# Altium project 6s Power Module.PrjPcb
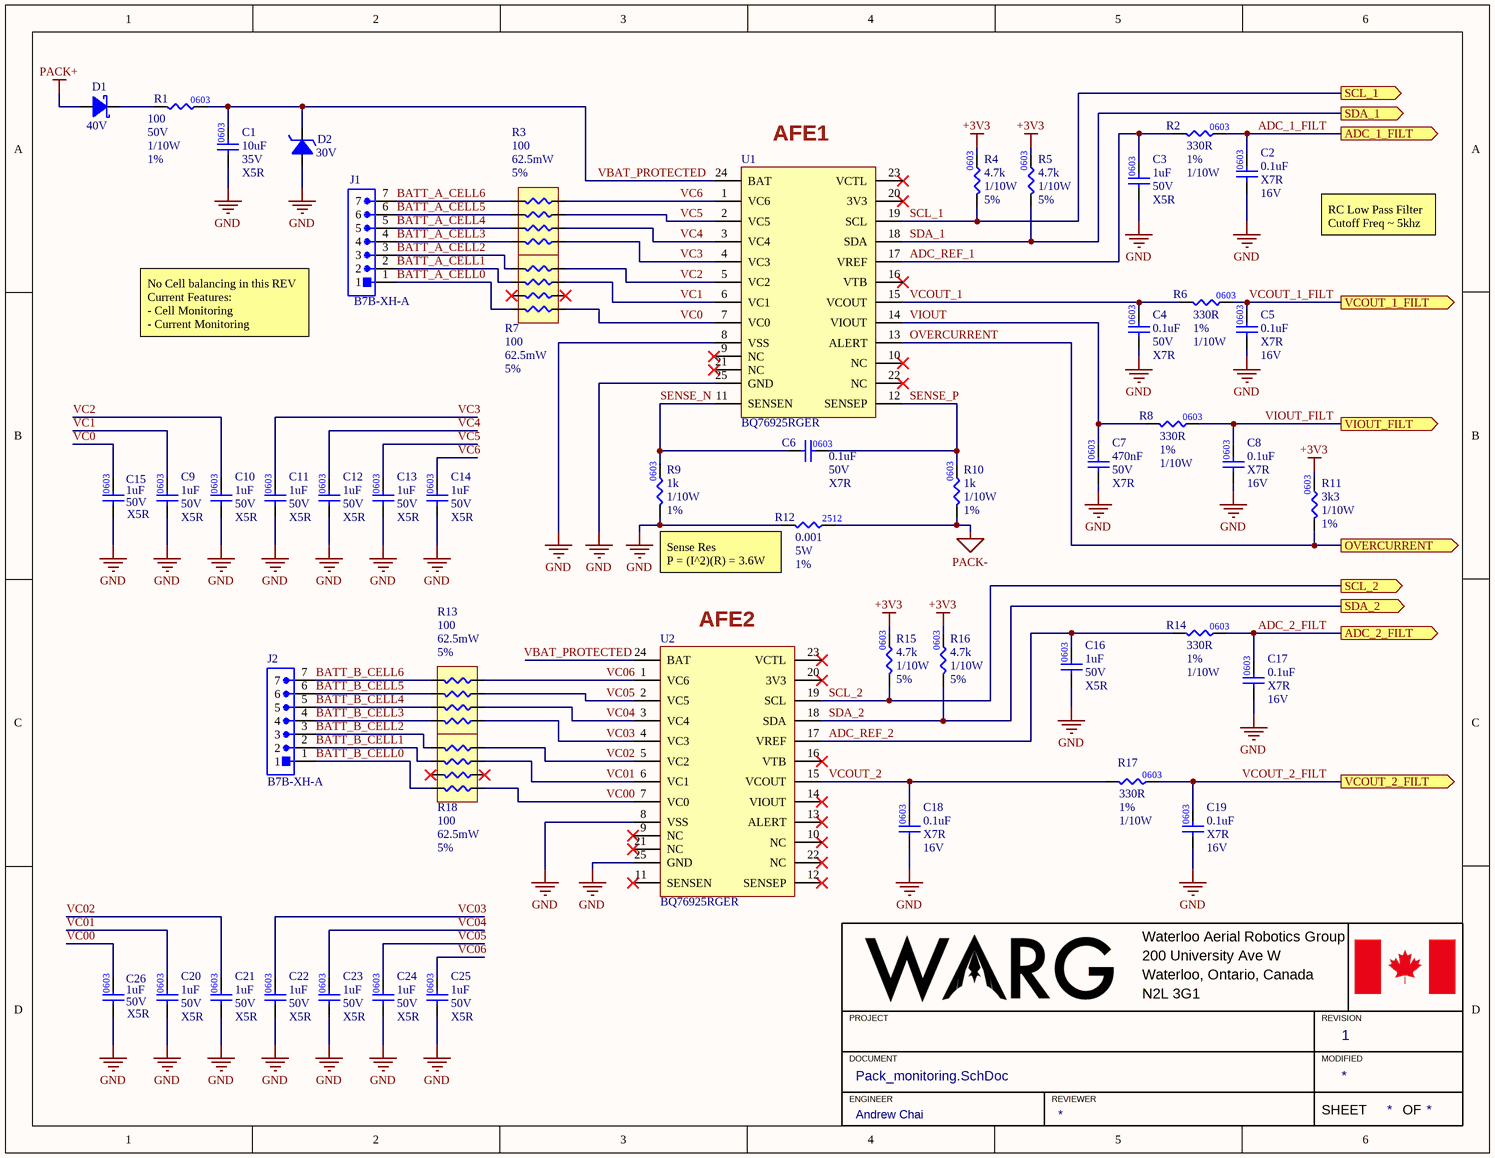
[diagram p0: Pack_monitoring.SchDoc]
3 sheets, 111 parts. Net scope: flat (ports and power ports of the same name join across sheets).
Board file: 6sPwr.PcbDoc
Sheets:
  Pack_monitoring.SchDoc
  MCU.SchDoc
  Power.SchDoc

## Sheet Pack_monitoring.SchDoc
size 279 x 215 mm; Engineer: Andrew Chai; Revision: 1

### Parts
C1  value 10uF  Rated DC Voltage (URdc): 35V  Temperature Characteristics Code: X5R  [.CAP_0603-Footprint-1]  (hidden comment: GRM188R6YA106MA73J)
C2  value 0.1uF  Temperature Coefficient: X7R  Voltage: 16V  [.CAP_0603-Footprint-1]  (hidden comment: GCM188R71C104KA37D)
C3  value 1uF  Voltage Rating: 50V  Temperature Characteristics Code: X5R  [.CAP_0603-Footprint-1]  (hidden comment: GRT188R61H105KE13D)
C4  Voltage: 50V  Dielectric: X7R  Capacitance: 0.1uF  [CAP0603]  (hidden comment: GCM188R71H104KA57D)
C5  value 0.1uF  Temperature Coefficient: X7R  Voltage: 16V  [.CAP_0603-Footprint-1]  (hidden comment: GCM188R71C104KA37D)
C6  Voltage: 50V  Dielectric: X7R  Capacitance: 0.1uF  [CAP0603]  (hidden comment: GCM188R71H104KA57D)
C7  Dielectric: X7R  Capacitance: 470nF  Voltage Rating: 50V  [FP-0603-L_1_6_0_1-W_0_8_0-IPC_A]  (hidden comment: UMK107B7474KA-TR)
C8  value 0.1uF  Temperature Coefficient: X7R  Voltage: 16V  [.CAP_0603-Footprint-1]  (hidden comment: GCM188R71C104KA37D)
C9  value 1uF  Voltage Rating: 50V  Temperature Characteristics Code: X5R  [.CAP_0603-Footprint-1]  (hidden comment: GRT188R61H105KE13D)
C10  value 1uF  Voltage Rating: 50V  Temperature Characteristics Code: X5R  [.CAP_0603-Footprint-1]  (hidden comment: GRT188R61H105KE13D)
C11  value 1uF  Voltage Rating: 50V  Temperature Characteristics Code: X5R  [.CAP_0603-Footprint-1]  (hidden comment: GRT188R61H105KE13D)
C12  value 1uF  Voltage Rating: 50V  Temperature Characteristics Code: X5R  [.CAP_0603-Footprint-1]  (hidden comment: GRT188R61H105KE13D)
C13  value 1uF  Voltage Rating: 50V  Temperature Characteristics Code: X5R  [.CAP_0603-Footprint-1]  (hidden comment: GRT188R61H105KE13D)
C14  value 1uF  Voltage Rating: 50V  Temperature Characteristics Code: X5R  [.CAP_0603-Footprint-1]  (hidden comment: GRT188R61H105KE13D)
C15  value 1uF  Voltage Rating: 50V  Temperature Characteristics Code: X5R  [.CAP_0603-Footprint-1]  (hidden comment: GRT188R61H105KE13D)
C16  value 1uF  Voltage Rating: 50V  Temperature Characteristics Code: X5R  [.CAP_0603-Footprint-1]  (hidden comment: GRT188R61H105KE13D)
C17  value 0.1uF  Temperature Coefficient: X7R  Voltage: 16V  [.CAP_0603-Footprint-1]  (hidden comment: GCM188R71C104KA37D)
C18  value 0.1uF  Temperature Coefficient: X7R  Voltage: 16V  [.CAP_0603-Footprint-1]  (hidden comment: GCM188R71C104KA37D)
C19  value 0.1uF  Temperature Coefficient: X7R  Voltage: 16V  [.CAP_0603-Footprint-1]  (hidden comment: GCM188R71C104KA37D)
C20  value 1uF  Voltage Rating: 50V  Temperature Characteristics Code: X5R  [.CAP_0603-Footprint-1]  (hidden comment: GRT188R61H105KE13D)
C21  value 1uF  Voltage Rating: 50V  Temperature Characteristics Code: X5R  [.CAP_0603-Footprint-1]  (hidden comment: GRT188R61H105KE13D)
C22  value 1uF  Voltage Rating: 50V  Temperature Characteristics Code: X5R  [.CAP_0603-Footprint-1]  (hidden comment: GRT188R61H105KE13D)
C23  value 1uF  Voltage Rating: 50V  Temperature Characteristics Code: X5R  [.CAP_0603-Footprint-1]  (hidden comment: GRT188R61H105KE13D)
C24  value 1uF  Voltage Rating: 50V  Temperature Characteristics Code: X5R  [.CAP_0603-Footprint-1]  (hidden comment: GRT188R61H105KE13D)
C25  value 1uF  Voltage Rating: 50V  Temperature Characteristics Code: X5R  [.CAP_0603-Footprint-1]  (hidden comment: GRT188R61H105KE13D)
C26  value 1uF  Voltage Rating: 50V  Temperature Characteristics Code: X5R  [.CAP_0603-Footprint-1]  (hidden comment: GRT188R61H105KE13D)
D1  Rep Pk Reverse Voltage-Max: 40V  [Copy of .SCHOTTKY-Footprint-1]  (hidden comment: MBR0540T1G)
D2  Reference Voltage-Nom: 30V  [BZT52C30-13-Footprint-1]  (hidden comment: BZT52C30-13)
J1  B7B-XH-A  [B7B-XH-A]
J2  B7B-XH-A  [B7B-XH-A]
R1  Resistance: 100  Voltage Rating (DC): 50V  Power Rating: 1/10W  Tolerance: 1%  [.RES_0603-Footprint-1]  (hidden comment: RC0603FR-07100RL)
R2  value 330R  Power: 1/10W  Tolerance: 1%  [.RES_0603-Footprint-1]  (hidden comment: AF0603FR-07330RL)
R3  value 100  Power: 62.5mW  Tolerance: 5%  [.RES_0603-Footprint-1]  (hidden comment: YC124JR-07100RL)
R4  value 4.7k  Resistance Tolerance: 5%  Power Rating: 1/10W  [.RES_0603-Footprint-1]  (hidden comment: RC0603JR-074K7L)
R5  value 4.7k  Resistance Tolerance: 5%  Power Rating: 1/10W  [.RES_0603-Footprint-1]  (hidden comment: RC0603JR-074K7L)
R6  value 330R  Power: 1/10W  Tolerance: 1%  [.RES_0603-Footprint-1]  (hidden comment: AF0603FR-07330RL)
R7  value 100  Power: 62.5mW  Tolerance: 5%  [.RES_0603-Footprint-1]  (hidden comment: YC124JR-07100RL)
R8  value 330R  Power: 1/10W  Tolerance: 1%  [.RES_0603-Footprint-1]  (hidden comment: AF0603FR-07330RL)
R9  value 1k  Power: 1/10W  Tolerance: 1%  [.RES_0603-Footprint-1]  (hidden comment: RC0603FR-071KL)
R10  value 1k  Power: 1/10W  Tolerance: 1%  [.RES_0603-Footprint-1]  (hidden comment: RC0603FR-071KL)
R11  value 3k3  Power: 1/10W  Tolerance: 1%  [.RES_0603-Footprint-1]  (hidden comment: RC0603FR-103K3L)
R12  value 0.001  Tolerance: 1%  Power: 5W  [.RES_0603-Footprint-1]  (hidden comment: CSS2H-2512R-1L00F)
R13  value 100  Power: 62.5mW  Tolerance: 5%  [.RES_0603-Footprint-1]  (hidden comment: YC124JR-07100RL)
R14  value 330R  Power: 1/10W  Tolerance: 1%  [.RES_0603-Footprint-1]  (hidden comment: AF0603FR-07330RL)
R15  value 4.7k  Resistance Tolerance: 5%  Power Rating: 1/10W  [.RES_0603-Footprint-1]  (hidden comment: RC0603JR-074K7L)
R16  value 4.7k  Resistance Tolerance: 5%  Power Rating: 1/10W  [.RES_0603-Footprint-1]  (hidden comment: RC0603JR-074K7L)
R17  value 330R  Power: 1/10W  Tolerance: 1%  [.RES_0603-Footprint-1]  (hidden comment: AF0603FR-07330RL)
R18  value 100  Power: 62.5mW  Tolerance: 5%  [.RES_0603-Footprint-1]  (hidden comment: YC124JR-07100RL)
U1  BQ76925RGER  [QFN50P400X400X100_HS-25N]
U2  BQ76925RGER  [QFN50P400X400X100_HS-25N]

### Ports
ADC_1_FILT (out), ADC_2_FILT (out), OVERCURRENT (out), SCL_1 (out), SCL_2 (out), SDA_1 (out), SDA_2 (out), VCOUT_1_FILT (out), VCOUT_2_FILT (out), VIOUT_FILT (out)

### Nets
+3V3: R4.2 R5.2 R11.2 R15.2 R16.2
GND: C1.1 C2.1 C3.1 C4.1 C5.1 C7.1 C8.1 C9.1 C10.1 C11.1 C12.1 C13.1 C14.1 C15.1 C16.1 C17.1 C18.1 C19.1 C20.1 C21.1 C22.1 C23.1 C24.1 C25.1 C26.1 D2.1(Anode) R9.1 R12.1 U1.8(VSS) U1.25(GND) U2.8(VSS) U2.25(GND)
PACK+: D1.1(Anode)
PACK-: R10.1 R12.2
ADC_1_FILT: C2.2 R2.2 ; port ADC_1_FILT
ADC_2_FILT: C17.2 R14.2 ; port ADC_2_FILT
ADC_REF_1: C3.2 R2.1 U1.17(VREF)
ADC_REF_2: C16.2 R14.1 U2.17(VREF)
BATT_A_CELL0: J1.1 R7.7
BATT_A_CELL1: J1.2 R7.3
BATT_A_CELL2: J1.3 R7.1
BATT_A_CELL3: J1.4 R3.7
BATT_A_CELL4: J1.5 R3.5
BATT_A_CELL5: J1.6 R3.3
BATT_A_CELL6: J1.7 R3.1
BATT_B_CELL0: J2.1 R18.7
BATT_B_CELL1: J2.2 R18.3
BATT_B_CELL2: J2.3 R18.1
BATT_B_CELL3: J2.4 R13.7
BATT_B_CELL4: J2.5 R13.5
BATT_B_CELL5: J2.6 R13.3
BATT_B_CELL6: J2.7 R13.1
OVERCURRENT: R11.1 U1.13(ALERT) ; port OVERCURRENT
SCL_1: R4.1 U1.19(SCL) ; port SCL_1
SCL_2: R15.1 U2.19(SCL) ; port SCL_2
SDA_1: R5.1 U1.18(SDA) ; port SDA_1
SDA_2: R16.1 U2.18(SDA) ; port SDA_2
SENSE_N: C6.1 R9.2 U1.11(SENSEN)
SENSE_P: C6.2 R10.2 U1.12(SENSEP)
VBAT_PROTECTED: C1.2 D2.2(Cathode) R1.2 U1.24(BAT) U2.24(BAT)
VC0: C15.2 R7.8 U1.7(VC0)
VC00: C26.2 R18.8 U2.7(VC0)
VC1: C9.2 R7.4 U1.6(VC1)
VC01: C20.2 R18.4 U2.6(VC1)
VC2: C10.2 R7.2 U1.5(VC2)
VC02: C21.2 R18.2 U2.5(VC2)
VC3: C11.2 R3.8 U1.4(VC3)
VC03: C22.2 R13.8 U2.4(VC3)
VC4: C12.2 R3.6 U1.3(VC4)
VC04: C23.2 R13.6 U2.3(VC4)
VC5: C13.2 R3.4 U1.2(VC5)
VC05: C24.2 R13.4 U2.2(VC5)
VC6: C14.2 R3.2 U1.1(VC6)
VC06: C25.2 R13.2 U2.1(VC6)
VCOUT_1: C4.2 R6.1 U1.15(VCOUT)
VCOUT_1_FILT: C5.2 R6.2 ; port VCOUT_1_FILT
VCOUT_2: C18.2 R17.1 U2.15(VCOUT)
VCOUT_2_FILT: C19.2 R17.2 ; port VCOUT_2_FILT
VIOUT: C7.2 R8.1 U1.14(VIOUT)
VIOUT_FILT: C8.2 R8.2 ; port VIOUT_FILT
NetD1_2: D1.2(Cathode) R1.1

Not connected (* = marked no-connect by the designer): R7 5* 6*; R18 5* 6*; U1 9(NC)* 10(NC)* 16(VTB)* 20(3V3)* 21(NC)* 22(NC)* 23(VCTL)*; U2 9(NC)* 10(NC)* 11(SENSEN)* 12(SENSEP)* 13(ALERT)* 14(VIOUT)* 16(VTB)* 20(3V3)* 21(NC)* 22(NC)* 23(VCTL)*

### Notes on the sheet
- (near U1) AFE1
- RC Low Pass Filter
  Cutoff Freq ~ 5khz
- No Cell balancing in this REV
  Current Features:
  - Cell Monitoring
  - Current Monitoring
- (near R12) Sense Res
  P = (I^2)(R) = 3.6W
- (near U2) AFE2
- Waterloo Aerial Robotics Group
- 200 University Ave W
- PROJECT
- Waterloo, Ontario, Canada
- N2L 3G1
- REVISION
- DOCUMENT
- ENGINEER
- REVIEWER
- MODIFIED
- SHEET
- OF

### Library data of the parts
C1 = CMP-001-00087-1: Ceramic Capacitor, Multilayer, Ceramic, 35V, 20% +Tol, 20% -Tol, X5R, 15% TC, 10uF, Surface Mount, 0603; Multilayer: Yes; Reach SVHC Compliant: Yes; Pins: 2; Tolerance (fill in as +-): 20%; Capacitor Type: Ceramic; JESD-609 Code: e3; Case/Package: 0603; RoHS Compliant: Yes; Package Shape: Rectangular; Tolerance  (fill in as +-): 20%; Dielectric Material: Ceramic; Min Operating Temperature: -55°C; Max Operating Temperature: 85°C; Packaging: Tape and Reel; Terminal Finish: Nickel; Termination: Wraparound; Mounting Technology: Surface Mount
C2 C5 C8 C17-C19 = CMP-001-00020-5: CAP CER 0.1uF 16V X7R 0603; Capactitance: 0.1uF; Package: 0603
C3 C9-C16 C20-C26 = CMP-00096-3: CAP CER 1UF 50V X5R 0603; Tolerance: 10%; Capacitor Type: Ceramic; Dielectric: X5R; Mount: Surface Mount; Capacitance: 1uF; Case/Package: 0603; Rated DC Voltage (URdc): 50V
C4 C6 = CMP-00047-2: CAP CER 0.1uF 50V X7R 0603; Tolerance: 10%; Mount: Surface Mount; Case Code (Imperial): 0603
C7 = CMP-00012-3: 0603 0.47 uF 50 V ±10% Tolerance X7R Multilayer Ceramic Capacitor; Tolerance: 10%; Case Code (Metric): 1608; Width: 0.031inch; Voltage: 50V; Voltage Rating (DC): 50V; Height: 0.8mm; Termination: SMD/SMT; Construction: Flat; Depth: 0.8mm; Max Operating Temperature: 125°C; Case Code (Imperial): 0603; Length: 1.6mm; Mount: Surface Mount; Radiation Hardening: No; Packaging: Tape and Reel; RoHS Compliant: Yes; Series: M; Thickness: 0.035inch; Lead Free: Lead Free; Min Operating Temperature: -55°C; Package Quantity: 1; Halogen Free: Halogen Free; Case/Package: 0603
D1 = CMP-004-00020-1: DIODE SCHOTTKY 40V 500MA SOD123; Forward Voltage: 620mV; Number of Elements: 1; Package Body Material: Plastic; Non-rep Pk Forward Current-Max: 5.5A; Diode Type: RECTIFIER; Time @ Peak Reflow Temperature-Max (s): 40s; Diode Element Material: SILICON; Qualification Status: Not Qualified; Additional Feature: FREE WHEELING DIODE; Pins: 2; Min Operating Temperature: -55°C; Reach SVHC Compliant: Yes; Surface Mount: Yes; RoHS Compliant: Yes; Peak Reflow Temperature (Cel): 260°C; Max Operating Temperature: 150°C; Moisture Sensitivity Level: 1; Terminal Position: DUAL; Package Style: SMALL OUTLINEMeter; JESD-609 Code: e3; JESD-30 Code: R-PDSO-G2; Package Shape: Rectangular; Terminal Finish: Tin; Terminal Form: Gull Wing; Technology: SCHOTTKY; Max Output current: 500mA
D2 = CMP-004-00021-1: Zener Diode, 30V V(Z), 6.67%, 0.5W, Silicon, Unidirectional; Max Power Dissipation: 500mW; Time @ Peak Reflow Temperature-Max (s): 10s; Package Body Material: Plastic; Test Current: 2mA; Number of Elements: 1; Qualification Status: Not Qualified; Voltage Tol-Max: 6.67%; Diode Type: ZENER; JESD-30 Code: R-PDSO-G2; Terminal Position: DUAL; Surface Mount: Yes; Pins: 2; Diode Element Material: SILICON; Technology: ZENER; Package Shape: Rectangular; Terminal Form: Gull Wing; Peak Reflow Temperature (Cel): 235°C; Terminal Finish: Tin; Polarity: Unidirectional; Package Style: SMALL OUTLINEMeter; Max Operating Temperature: 150°C; JESD-609 Code: e0; Min Operating Temperature: -65°C; RoHS Compliant: No
J1 J2 = CMP-002-00021-4: Header B7B-XH-A, 2.50mm, 7-contacts, top entry, THT /500/box; MF: JST Sales; MP: B7B-XH-A; Design Item ID: B7B-XH-A; Pin Count: 7; Check_prices: https://www.snapeda.com/parts/S5B-XH-A/JST+Sales+America+Inc./view-part/?ref=eda; Component Type: Standard; Package: None
R1 = CMP-00022-3: RES 100 OHM 1% 1/10W 0603; Temperature Coefficient: 100ppm/°C; Max Power Dissipation: 100mW; Case Code (Imperial): 0603; Lead Free: Lead Free; Resistance Tolerance: 1%; Height: 0.45mm; Min Operating Temperature: -55°C; Case Code (Metric): 1608; Technology: THICK FILM; Max Operating Temperature: 155°C; Military Standard: Not; Length: 1.6mm; Width: 0.8mm; Number of Terminations: 2; Construction: Rectangular; Features: Moisture Resistant; REACH SVHC: Unknown; Series: RC; Depth: 0.8mm; Voltage Rating: 50V; Resistor Type: Thick Film; RoHS Compliant: Yes; Case/Package: 0603; Size Code: 0603; Termination: SMD/SMT; Packaging: Tape and Reel; Number of Pins: 2
R2 R6 R8 R14 R17 = CMP-009-00099-1: Fixed Resistor, Metal Glaze/thick Film, 0.1W, 330ohm, 75V, 1% +/-Tol, 100ppm/Cel, Surface Mount, 0603; Resistance: 330; Reference Standard: AEC-Q200; Rated Temperature: 70°C; Package Width: 0.8mm; Package Length: 1.6mm; Additional Feature: ANTI-SULFUR; Package Height: 0.45mm; Temperature Coefficient: 100ppm/°C; Case/Package: 0603; Reach SVHC Compliant: Yes; Working Voltage: 75V; Package Style: SMTMeter; Mounting Technology: Surface Mount; Package: 0603; Resistor Type: FIXED RESISTOR; Max Operating Temperature: 155°C; Pins: 2; Termination: Wraparound; Min Operating Temperature: -55°C; RoHS Compliant: Yes; Packaging: Tape and Reel; Construction: Rectangular
R3 R7 R13 R18 = CMP-009-00095-1: YC124 Series 4 Elements 100 Ohms 5 % Case 4 x 0402 SMD Chip Resistor Network; Package: 0804; Resistance: 100
R4 R5 R15 R16 = CMP-009-00019-3: RES 4.7K OHM 5% 1/10W 0603; Voltage Rating (DC): 50V; Case/Package: 0603; Resistance: 4.7k
R9 R10 = CMP-009-00012-3: RES 1k OHM 1% 1/10W 0603; Case/Package: 0603
R11 = CMP-00168-2: RES 3.3K OHM 1% 1/10W 0603; Rated Temperature: 70°C; Working Voltage: 75V; Case/Package: 0603
R12 = CMP-009-00094-1: Fixed Resistor, Metal Strip, 5W, 0.001ohm, 1% +/-Tol, 50ppm/Cel, Surface Mount, 2512; Package Length: 6.35mm; Temperature Coefficient: 50ppm/°C; Package Width: 3.05mm; Package Height: 0.42mm; Resistance: 0.001; Package Shape: Rectangular; Min Operating Temperature: -55°C; Packaging: Tape and Reel; Technology: METAL ALLOY; Package Style: SMTMeter; Case/Package: 2512; Max Operating Temperature: 170°C; Package: 2512; RoHS Compliant: Yes; Resistor Type: FIXED RESISTOR; Pins: 2; Reach SVHC Compliant: Yes; Construction: Rectangular
U1 U2 = CMP-00274-1: Power Supply Support Circuit, Adjustable, 1 Channel, PQCC24; Qualification Status: Not Qualified; Adjustable Threshold: Yes; Max Supply Voltage: 26.4V; Nominal Supply Voltage: 21.6V; Package Body Material: Plastic; Number of Channels: 1; Supply Current-Max (Isup): 48uA; Power Supplies: 4.2/26.4V; Package Equivalence Code: LCC24,.16SQ,20; Min Supply Voltage: 4.2V; RoHS Compliant: Yes; Surface Mount: Yes; Terminal Pitch: 0.5mm; Terminal Finish: Nickel; Min Operating Temperature: -25°C; Throw Configuration: POWER SUPPLY SUPPORT CIRCUIT; Reach SVHC Compliant: Yes; JESD-30 Code: R-PDSO-G20; Width: 4mm; Case/Package: HVQCCN; JESD-609 Code: e4; Pins: 24; Peak Reflow Temperature (Cel): 260°C; Height - Seated (Max): 1mm; Channels: 1; Length: 4mm; Package Shape: Square; Max Operating Temperature: 85°C; Temperature Grade: OTHER; Moisture Sensitivity Level: 2; Terminal Form: No Lead; Terminal Position: QUAD; Package Style: CHIP CARRIER, HEAT SINK/SLUG, VERY THIN PROFILEMeter

## Sheet MCU.SchDoc
size 279 x 215 mm
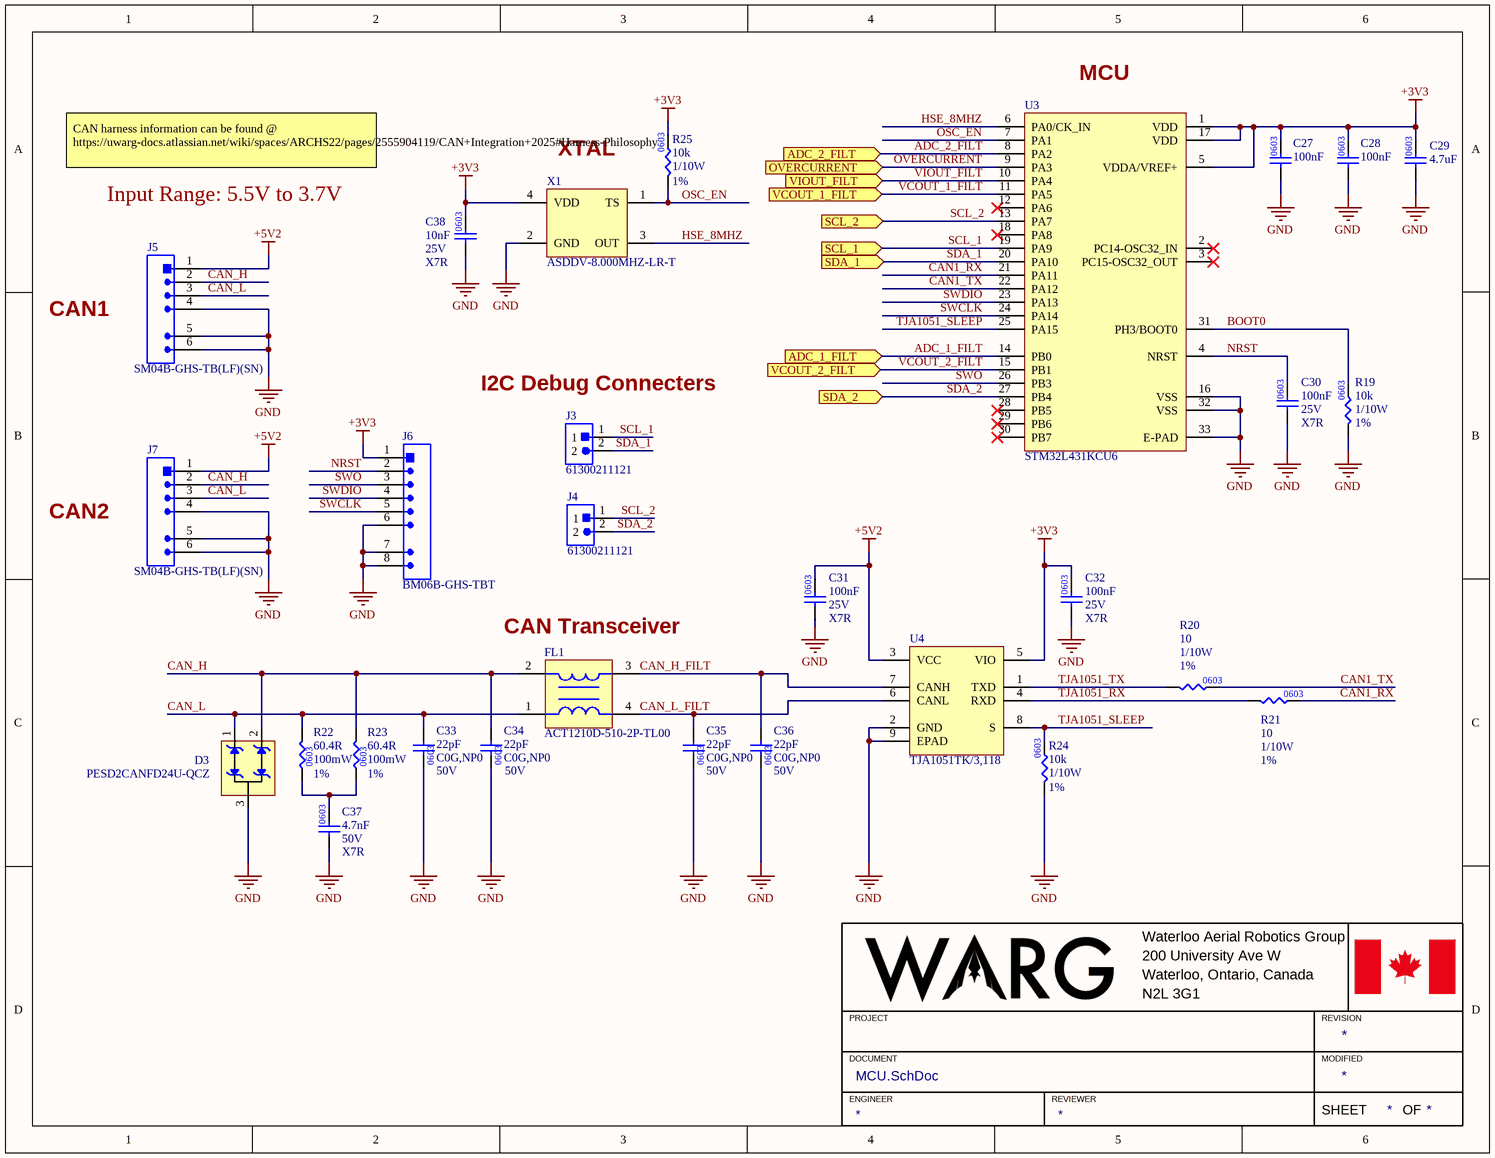
[diagram p1: MCU.SchDoc]

### Parts
C27  value 100nF  [.CAP_0603-Footprint-1]  (hidden comment: GCM188R71C104KA37D)
C28  value 100nF  [.CAP_0603-Footprint-1]  (hidden comment: GCM188R71C104KA37D)
C29  value 4.7uF  [.CAP_0603-Footprint-1]  (hidden comment: GRM188C81E475KE11D)
C30  Voltage Rating: 25V  Dielectric: X7R  Capacitance: 100nF  [.CAP_0603-Footprint-1]  (hidden comment: CL10B104KA8NNNC)
C31  Voltage Rating: 25V  Dielectric: X7R  Capacitance: 100nF  [.CAP_0603-Footprint-1]  (hidden comment: CL10B104KA8NNNC)
C32  Voltage Rating: 25V  Dielectric: X7R  Capacitance: 100nF  [.CAP_0603-Footprint-1]  (hidden comment: CL10B104KA8NNNC)
C33  value 22pF  Temperature Coefficient: C0G,NP0  Voltage Rating: 50V  [.CAP_0603-Footprint-1]  (hidden comment: CC0603JRNPO9BN220)
C34  value 22pF  Temperature Coefficient: C0G,NP0  Voltage Rating: 50V  [.CAP_0603-Footprint-1]  (hidden comment: CC0603JRNPO9BN220)
C35  value 22pF  Temperature Coefficient: C0G,NP0  Voltage Rating: 50V  [.CAP_0603-Footprint-1]  (hidden comment: CC0603JRNPO9BN220)
C36  value 22pF  Temperature Coefficient: C0G,NP0  Voltage Rating: 50V  [.CAP_0603-Footprint-1]  (hidden comment: CC0603JRNPO9BN220)
C37  value 4.7nF  Rated DC Voltage (URdc): 50V  Temperature Characteristics Code: X7R  [.CAP_0603-Footprint-1]  (hidden comment: GCM188R71H472KA37D)
C38  Temperature Coefficient: X7R  Voltage Rating: 25V  Capacitance: 10nF  [.CAP_0603-Footprint-1]  (hidden comment: CC0603KRX7R8BB103)
D3  PESD2CANFD24U-QCZ  [PESD2CANFD24U-QCZ-Footprint-1]
FL1  ACT1210D-510-2P-TL00  [ACT1210D-510-2P-TL00-Footprint-1]
J3  61300211121  [61300211121]
J4  61300211121  [61300211121]
J5  SM04B-GHS-TB(LF)(SN)  [CONN_SM04B-GHS-TB_JST]
J6  BM06B-GHS-TBT  [BM06B-GHS-TBT-Footprint-1]
J7  SM04B-GHS-TB(LF)(SN)  [CONN_SM04B-GHS-TB_JST]
R19  value 10k  Power: 1/10W  Tolerance: 1%  [.RES_0603-Footprint-1]  (hidden comment: RC0603FR-0710KL)
R20  value 10  Power: 1/10W  Tolerance: 1%  [.RES_0603-Footprint-1]  (hidden comment: RC0603FR-0710RL)
R21  value 10  Power: 1/10W  Tolerance: 1%  [.RES_0603-Footprint-1]  (hidden comment: RC0603FR-0710RL)
R22  value 60.4R  Tolerance: 1%  Power: 100mW  [RES0603]  (hidden comment: RC0603FR-1360R4L)
R23  value 60.4R  Tolerance: 1%  Power: 100mW  [RES0603]  (hidden comment: RC0603FR-1360R4L)
R24  value 10k  Power: 1/10W  Tolerance: 1%  [.RES_0603-Footprint-1]  (hidden comment: RC0603FR-0710KL)
R25  value 10k  Power: 1/10W  Tolerance: 1%  [.RES_0603-Footprint-1]  (hidden comment: RC0603FR-0710KL)
U3  STM32L431KCU6  [STM32L431KCU6-Footprint-1]
U4  TJA1051TK/3,118  [TJA1051TK_3,118-Footprint-1]
X1  ASDDV-8.000MHZ-LR-T  [ASDDV-8.000MHZ-LR-T-Footprint-1]

### Ports
ADC_1_FILT (in), ADC_2_FILT (in), OVERCURRENT (in), SCL_1 (in), SCL_2 (in), SDA_1 (in), SDA_2 (in), VCOUT_1_FILT (in), VCOUT_2_FILT (in), VIOUT_FILT (in)

### Nets
+3V3: C27.2 C28.2 C29.2 C32.2 C38.2 J6.1 R25.2 U3.1(VDD) U3.5(VDDA/VREF+) U3.17(VDD) U4.5(VIO) X1.4(VDD)
+5V2: C31.2 J5.1 J7.1 U4.3(VCC)
GND: C27.1 C28.1 C29.1 C30.1 C31.1 C32.1 C33.1 C34.1 C35.1 C36.1 C37.1 C38.1 D3.3(CC) J5.4 J5.5 J5.6 J6.6 J6.7 J6.8 J7.4 J7.5 J7.6 R19.1 R24.1 U3.16(VSS) U3.32(VSS) U3.33(E-PAD) U4.2(GND) U4.9(EPAD) X1.2(GND)
ADC_1_FILT: U3.14(PB0) ; port ADC_1_FILT
ADC_2_FILT: U3.8(PA2) ; port ADC_2_FILT
BOOT0: R19.2 U3.31(PH3/BOOT0)
CAN1_RX: R21.2 U3.21(PA11)
CAN1_TX: R20.2 U3.22(PA12)
CAN_H: C34.2 D3.2(K2) FL1.2 J5.2 J7.2 R23.2
CAN_H_FILT: C36.2 FL1.3 U4.7(CANH)
CAN_L: C33.2 D3.1(K1) FL1.1 J5.3 J7.3 R22.2
CAN_L_FILT: C35.2 FL1.4 U4.6(CANL)
HSE_8MHZ: U3.6(PA0/CK_IN) X1.3(OUT)
NRST: C30.2 J6.2 U3.4(NRST)
OSC_EN: R25.1 U3.7(PA1) X1.1(TS)
OVERCURRENT: U3.9(PA3) ; port OVERCURRENT
SCL_1: J3.1 U3.19(PA9) ; port SCL_1
SCL_2: J4.1 U3.13(PA7) ; port SCL_2
SDA_1: J3.2 U3.20(PA10) ; port SDA_1
SDA_2: J4.2 U3.27(PB4) ; port SDA_2
SWCLK: J6.5 U3.24(PA14)
SWDIO: J6.4 U3.23(PA13)
SWO: J6.3 U3.26(PB3)
TJA1051_RX: R21.1 U4.4(RXD)
TJA1051_SLEEP: R24.2 U3.25(PA15) U4.8(S)
TJA1051_TX: R20.1 U4.1(TXD)
VCOUT_1_FILT: U3.11(PA5) ; port VCOUT_1_FILT
VCOUT_2_FILT: U3.15(PB1) ; port VCOUT_2_FILT
VIOUT_FILT: U3.10(PA4) ; port VIOUT_FILT
NetC37_2: C37.2 R22.1 R23.1

Not connected (* = marked no-connect by the designer): U3 2(PC14-OSC32_IN)* 3(PC15-OSC32_OUT)* 12(PA6)* 18(PA8)* 28(PB5)* 29(PB6)* 30(PB7)*

### Notes on the sheet
- (near U3) MCU
- CAN harness information can be found @ https://uwarg-docs.atlassian.net/wiki/spaces/ARCHS22/pages/2555904119/CAN+Integration+2025#Harness-Philosophy
- XTAL
- Input Range: 5.5V to 3.7V
- CAN1
- (near J3) I2C Debug Connecters
- CAN2
- (near FL1) CAN Transceiver
- Waterloo Aerial Robotics Group
- 200 University Ave W
- PROJECT
- Waterloo, Ontario, Canada
- N2L 3G1
- REVISION
- DOCUMENT
- ENGINEER
- REVIEWER
- MODIFIED
- SHEET
- OF
- (in symbol CMP-00245-1) 0603

### Library data of the parts
C27 C28 = CMP-001-00003-8: CAP CER 100nF 16V X7R 0603; Capacitance: 100nF; Package: 0603; Voltage: 16V
C29 = CMP-001-00002-10: CAP CER 4.7uF 25V X6S 0603; Voltage: 25V; Capacitance: 4.7uF; Dielectric: X6S; Package: 0603
C30-C32 = CMP-00057-2: CAP CER 0.1UF 25V X7R 0603; Tolerance: 10%; Case/Package: 0603
C33-C36 = CMP-00246-2: CAP CER 22PF 50V C0G/NPO 0603; Tolerance: 5%; Case/Package: 0603
C37 = CMP-001-00080-1: CAP CER 4700PF 50V X7R 0603; Tolerance (fill in as +-): 10%; Multilayer: Yes; Capacitor Type: Ceramic; Reference Standard: AEC-Q200; Pins: 2; Package Shape: Rectangular; Reach SVHC Compliant: Yes; RoHS Compliant: Yes; Height: 0.9mm; Terminal Finish: Nickel; Termination: Wraparound; Width: 0.8mm; Mounting Technology: Surface Mount; JESD-609 Code: e3; Package Style: SMTMeter; Length: 1.6mm; Packaging: Tape and Reel; Tolerance  (fill in as +-): 10%; Case/Package: 0603; Max Operating Temperature: 125°C; Min Operating Temperature: -55°C; Dielectric Material: Ceramic
C38 = CMP-00217-1: CAP CER 10nF 25V X7R 0603; Package: 0603
D3 = CMP-00239-5: TVS DIODE 24VWM 43VC DFN1412D-3
FL1 = CMP-00243-2: CMC 50UH 115MA 2LN 2.3KOHM SMD
J3 J4 = CMP-00165-2: CONN HEADER VERT 2POS 2.54MM; Operating Temperature Range: -40°C ~ 105°C; Mounting Type: TH
J5 J7 = CMP-068-000000-3: Conn Shrouded Header HDR 4 POS 1.25mm Solder RA SMD Reel; Mfr_Name: JST; Source: SM04B-GHS-TB_LF__SN_.SchLib; RefDes: RefDes; Design Item ID: SM04B-GHS-TB(LF)(SN); Type: Type
J6 = CMP-002-00014-7: Connector Header Surface Mount 6 position 0.049" (1.25mm); Mfr Name: JST; Design Item ID: BM06B-GHS-TBT
R19 R24 R25 = CMP-009-00006-4: RES 10K OHM 1% 1/10W 0603; Resistance: 10k; Package: 0603
R20 R21 = CMP-009-00084-1: RES 10 OHM 1% 1/10W 0603; Resistance: 10; Package: 0603
R22 R23 = CMP-00245-1: RES 60.4 OHM 1% 1/10W 0603
U3 = CMP-00224-5: IC MCU 32BIT 256KB FLSH 32UFQFPN
U4 = CMP-00219-3: IC TRANSCEIVER HALF 1/1 8HVSON
X1 = CMP-00242-3: OSC XO 8.000MHZ CMOS SMD; Frequence Stability: 25ppm; Frequency: 8MHz

## Sheet Power.SchDoc
size 279 x 215 mm; Engineer: Andrew Chai
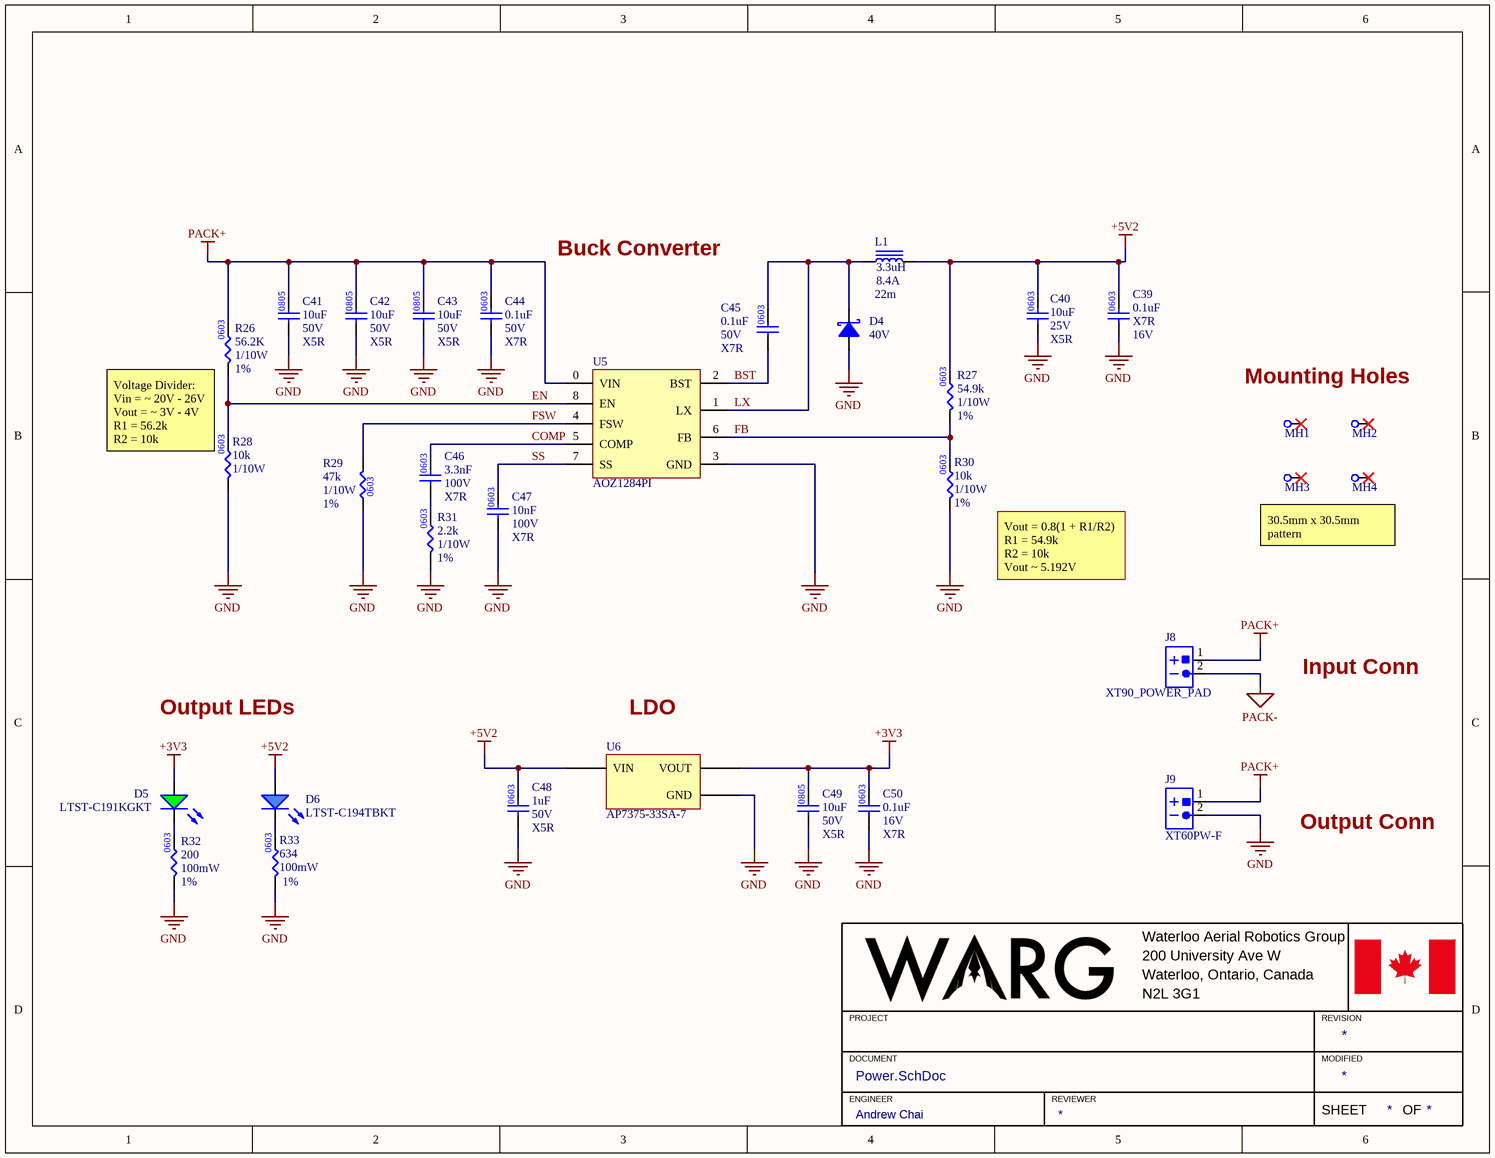
[diagram p2: Power.SchDoc]

### Parts
C39  value 0.1uF  Temperature Coefficient: X7R  Voltage: 16V  [.CAP_0603-Footprint-1]  (hidden comment: GCM188R71C104KA37D)
C40  value 10uF  Voltage Rating: 25V  Temperature Coefficient: X5R  [.CAP_0603-Footprint-1]  (hidden comment: GRM188R61E106KA73J)
C41  value 10uF  Voltage Rating: 50V  Dielectric: X5R  [.CAP_0805-Footprint-1]  (hidden comment: GRM21BR61H106KE43L)
C42  value 10uF  Voltage Rating: 50V  Dielectric: X5R  [.CAP_0805-Footprint-1]  (hidden comment: GRM21BR61H106KE43L)
C43  value 10uF  Voltage Rating: 50V  Dielectric: X5R  [.CAP_0805-Footprint-1]  (hidden comment: GRM21BR61H106KE43L)
C44  Voltage: 50V  Dielectric: X7R  Capacitance: 0.1uF  [CAP0603]  (hidden comment: GCM188R71H104KA57D)
C45  Voltage: 50V  Dielectric: X7R  Capacitance: 0.1uF  [CAP0603]  (hidden comment: GCM188R71H104KA57D)
C46  value 3.3nF  Temperature Characteristics Code: X7R  Rated DC Voltage (URdc): 100V  [.CAP_0603-Footprint-1]  (hidden comment: GCM188R72A332KA37D)
C47  value 10nF  Rated DC Voltage (URdc): 100V  Temperature Characteristics Code: X7R  [CAP0603]  (hidden comment: GCM188R72A103KA37D)
C48  value 1uF  Voltage Rating: 50V  Temperature Characteristics Code: X5R  [.CAP_0603-Footprint-1]  (hidden comment: GRT188R61H105KE13D)
C49  value 10uF  Voltage Rating: 50V  Dielectric: X5R  [.CAP_0805-Footprint-1]  (hidden comment: GRM21BR61H106KE43L)
C50  value 0.1uF  Temperature Coefficient: X7R  Voltage: 16V  [.CAP_0603-Footprint-1]  (hidden comment: GCM188R71C104KA37D)
D4  Max Reverse Voltage (DC): 40V  [DIOM4426X24N]  (hidden comment: SK54A-LTP)
D5  LTST-C191KGKT  [.LED_0603-Footprint-1]
D6  LTST-C194TBKT  [LTST-C194TBKT-Footprint-1]
J8  XT90_POWER_PAD  [XT90_POWER_PAD-Footprint-1]
J9  XT60PW-F  [XT60PW-F-Footprint-1]
L1  DC Resistance: 22m  Current: 8.4A  Inductance: 3.3uH  [0630CDMCCDS-3R3MC-Footprint-1]  (hidden comment: 0630CDMCCDS-3R3MC)
MH1  M2HOLE-STANDARD  [M2HOLE-STANDARD-Footprint-1]  (value not drawn)
MH2  M2HOLE-STANDARD  [M2HOLE-STANDARD-Footprint-1]  (value not drawn)
MH3  M2HOLE-STANDARD  [M2HOLE-STANDARD-Footprint-1]  (value not drawn)
MH4  M2HOLE-STANDARD  [M2HOLE-STANDARD-Footprint-1]  (value not drawn)
R26  value 56.2K  Power: 1/10W  Tolerance: 1%  [.RES_0603-Footprint-1]  (hidden comment: RC0603FR-0756K2L)
R27  Power Rating: 1/10W  Resistance: 54.9k  Tolerance: 1%  [.RES_0603-Footprint-1]  (hidden comment: RC0603FR-0754K9L)
R28  value 10k  Power: 1/10W  [.RES_0603-Footprint-1]  (hidden comment: RC0603FR-0710KL)
R29  value 47k  POWER: 1/10W  TOLERANCE: 1%  [RC0603FR-0756K2L-Footprint-1]  (hidden comment: RC0603FR-0747KL)
R30  value 10k  Power: 1/10W  Tolerance: 1%  [.RES_0603-Footprint-1]  (hidden comment: RC0603FR-0710KL)
R31  value 2.2k  Resistance Tolerance: 1%  Max Power Dissipation: 1/10W  [.RES_0603-Footprint-1]  (hidden comment: RC0603FR-072K2L)
R32  Tolerance: 1%  Power Rating: 100mW  Resistance: 200  [.RES_0603-Footprint-1]  (hidden comment: RC0603FR-07200RL)
R33  value 634  Tolerance: 1%  Power: 100mW  [.RES_0603-Footprint-1]  (hidden comment: RC0603FR-07634RL)
U5  AOZ1284PI  [AOZ1284PI-Footprint-1]
U6  AP7375-33SA-7  [AP7375-33SA-7-Footprint-1]

### Nets
+3V3: C49.2 C50.2 D5.1(A) U6.2(VOUT)
+5V2: C39.2 C40.2 C48.2 D6.1(A) L1.2 R27.2 U6.1(VIN)
GND: C39.1 C40.1 C41.1 C42.1 C43.1 C44.1 C47.1 C48.1 C49.1 C50.1 D4.1(Anode) J9.2 R28.1 R29.1 R30.1 R31.1 R32.1 R33.1 U5.3(GND) U6.3(GND)
PACK+: C41.2 C42.2 C43.2 C44.2 J8.1 J9.1 R26.2 U5.0(VIN)
PACK-: J8.2
BST: C45.1 U5.2(BST)
COMP: C46.2 U5.5(COMP)
EN: R26.1 R28.2 U5.8(EN)
FB: R27.1 R30.2 U5.6(FB)
FSW: R29.2 U5.4(FSW)
LX: C45.2 D4.2(Cathode) L1.1 U5.1(LX)
SS: C47.2 U5.7(SS)
NetC46_1: C46.1 R31.2
NetD5_2: D5.2(K) R32.2
NetD6_2: D6.2(K) R33.2

Not connected (* = marked no-connect by the designer): MH1 1*; MH2 1*; MH3 1*; MH4 1*

### Notes on the sheet
- Buck Converter
- Mounting Holes
- Voltage Divider:
  Vin = ~ 20V - 26V
  Vout = ~ 3V - 4V
  R1 = 56.2k
  R2 = 10k
- 30.5mm x 30.5mm pattern
- (near R30) Vout = 0.8(1 + R1/R2)
  R1 = 54.9k
  R2 = 10k
  Vout ~ 5.192V
- Output LEDs
- (near U6) LDO
- Input Conn
- Output Conn
- Waterloo Aerial Robotics Group
- 200 University Ave W
- PROJECT
- Waterloo, Ontario, Canada
- N2L 3G1
- REVISION
- DOCUMENT
- ENGINEER
- REVIEWER
- MODIFIED
- SHEET
- OF
- (in symbol CMP-00247-1) 0603

### Library data of the parts
C39 C50 = CMP-001-00020-5: CAP CER 0.1uF 16V X7R 0603; Capactitance: 0.1uF; Package: 0603
C40 = CMP-00056-4: CAP CER 10UF 25V X5R 0603; Case/Package: 0603
C41-C43 C49 = CMP-001-00009-4: CAP CER 10uF 50V X5R 0805; Voltage: 50V; Package: 0805; Capacitance: 10uF
C44 C45 = CMP-00047-2: as C4 on sheet Pack_monitoring; Mount: Surface Mount; Case Code (Imperial): 0603
C46 = CMP-001-00086-1: Ceramic Capacitor, Multilayer, Ceramic, 100V, 10% +Tol, 10% -Tol, X7R, 15% TC, 0.0033uF, Surface Mount, 0603; Multilayer: Yes; Reference Standard: AEC-Q200; Terminal Finish: Nickel; Termination: Wraparound; Capacitor Type: Ceramic; Width: 0.8mm; Dielectric Material: Ceramic; JESD-609 Code: e3; Tolerance (fill in as +-): 10%; Mounting Technology: Surface Mount; Tolerance  (fill in as +-): 10%; Max Operating Temperature: 125°C; Package Shape: Rectangular; Length: 1.6mm; Packaging: Tape and Reel; Pins: 2; Height: 0.9mm; Package Style: SMTMeter; RoHS Compliant: Yes; Min Operating Temperature: -55°C; Case/Package: 0603; Reach SVHC Compliant: Yes
C47 = CMP-00247-1: CAP CER 10000PF 100V X7R 0603; Tolerance: 10%
C48 = CMP-00096-3: as C3 on sheet Pack_monitoring; Dielectric: X5R; Mount: Surface Mount; Capacitance: 1uF; Case/Package: 0603; Rated DC Voltage (URdc): 50V
D4 = CMP-00102-3: Diode Schottky 40V 5A 2-Pin SMA T/R; Case/Package: SMA; Average Rectified Current: 5A
D5 = CMP-001-00018-6: LED GREEN 2V 0603; Forward Current: 20mA; Case/Package: 0603; Forward Voltage: 2V; Color: Green
D6 = CMP-00017-2: LED BLUE CLEAR 0603 SMD; Lens Style: Flat,Diffused,Colorless,Rectangular; Lens Size: 0.8mm; Lens Color: Colorless; Test Current: 5mA; Forward Voltage: 2.8V; Number of Elements: 1; Voltage: 29V; Viewing Angle: 130°; Reverse Voltage: 5V; Dominant Wavelength: 473nm; Power Dissipation: 76mW; Forward Current: 20mA; Luminous Intensity: 15mcd; Length: 1.6mm; Depth: 0.8mm; Radiation Hardening: No; Height: 0.65mm; Lens Transparency: Clear; Number of Pins: 2; Case/Package: 0603; Illumination Color: Blue; Case Code (Imperial): 0603; RoHS Compliant: Yes; Mount: Surface Mount; Color: Blue; Width: 0.8mm; Packaging: Tape and Reel; Max Operating Temperature: 80°C; Number of LEDs: 1; Lead Free: Lead Free; Min Operating Temperature: -20°C; Package Quantity: 5000; Case Code (Metric): 1608; Series: -
J8 = CMP-001-0016-1: XT90_POWER_PAD, 4.5mm Square Pad, 6.5mm Pitch
J9 = CMP-00086-5: Board Mount XT60PW-F 2 Pin Female Connector; Manufacturer: TME
L1 = CMP-006-00015-1: General Purpose Inductor, 3.3uH, 20%, 1 Element, SMD; Tolerance: +/- 20%; Saturation Current: 11.4A; Inductor Type: GENERAL PURPOSE INDUCTOR; RoHS Compliant: Yes
MH1-MH4 = CMP-00092-5: RFC in progress (Dimensions currently unapproved); Annular Ring Diameter: 4.2mm; Through Hole Diameter: 2.4mm
R26 = CMP-009-00046-1: RES 56.2K OHM 1% 1/10W 0603; Resistance: 56.2k; Package: 0603
R27 = CMP-001-00025-1: RES 54.9k OHM 1% 1/10@ 0603; Voltage Rating: 50V; Case/Package: 0603
R28 R30 = CMP-009-00006-4: RES 10K OHM 1% 1/10W 0603; Resistance: 10k; Package: 0603
  R28: Tolerance: 1%
R29 = CMP-009-00091-1: RES 47K OHM 1% 1/10W 0603; Package Width: 0.8mm; Working Voltage: 75V; Temperature Coefficient: 100ppm/°C; Rated Temperature: 70°C; Package Length: 1.6mm; Package Height: 0.45mm; Additional Feature: LASER TRIMMABLE; Packaging: Tape and Reel; Construction: Chip; Package Shape: Rectangular; Technology: METAL GLAZE/THICK FILM; JESD-609 Code: e3; Max Operating Temperature: 155°C; Package Style: SMTMeter; Reach SVHC Compliant: Yes; Min Operating Temperature: -55°C; Termination: Wraparound; Case/Package: 0603; Resistor Type: FIXED RESISTOR; Terminal Finish: Nickel; RoHS Compliant: Yes; Mounting Technology: Surface Mount; Pins: 2
R31 = CMP-009-00022-2: RES 2.2K OHM 0603 1/10W; Voltage Rating: 50V; Case/Package: 0603
R32 = CMP-00103-1: RES 200 OHM 1% 1/10W 0603; Voltage Rating: 50V; Case/Package: 0603
R33 = CMP-00251-1: RES 634 OHM 1% 1/10W 0603; Case/Package: 0603
U5 = CMP-00257-2: IC REG BUCK ADJUSTABLE 4A 8SO; Manufacturer 1: Alpha & Omega Semiconductor Inc.; Supplier 1: Digikey; Manufacturer Part Number 1: AOZ1284PI; Supplier Part Number 1: 785-1689-1-ND
U6 = CMP-002-000009-1: IC REG LIN 3.3V 300MA SOT23-3; Output Type: Fixed; Voltage - Input (Max): 45V; Voltage Dropout (Max): 0.36V @ 100mA; Current - Quiescent (Iq): 5 µA; Operating Temperature: -40°C ~ 125°C (TJ); Voltage - Output (Min/Fixed): 3.3V; Supplier Device Package: SOT-23-3; Current - Output: 300mA

## Nets that join several sheets
+3V3: Pack_monitoring (5 pins), MCU (12 pins), Power (C49.2 C50.2 D5.1 U6.2)
+5V2: MCU (C31.2 J5.1 J7.1 U4.3), Power (7 pins)
GND: Pack_monitoring (32 pins), MCU (30 pins), Power (20 pins)
PACK+: Pack_monitoring (D1.1), Power (8 pins)
PACK-: Pack_monitoring (R10.1 R12.2), Power (J8.2)
ADC_1_FILT: Pack_monitoring (C2.2 R2.2), MCU (U3.14)
ADC_2_FILT: Pack_monitoring (C17.2 R14.2), MCU (U3.8)
OVERCURRENT: Pack_monitoring (R11.1 U1.13), MCU (U3.9)
SCL_1: Pack_monitoring (R4.1 U1.19), MCU (J3.1 U3.19)
SCL_2: Pack_monitoring (R15.1 U2.19), MCU (J4.1 U3.13)
SDA_1: Pack_monitoring (R5.1 U1.18), MCU (J3.2 U3.20)
SDA_2: Pack_monitoring (R16.1 U2.18), MCU (J4.2 U3.27)
VCOUT_1_FILT: Pack_monitoring (C5.2 R6.2), MCU (U3.11)
VCOUT_2_FILT: Pack_monitoring (C19.2 R17.2), MCU (U3.15)
VIOUT_FILT: Pack_monitoring (C8.2 R8.2), MCU (U3.10)